# Altium schematic sheet CAN.SchDoc
size A4; SheetNumber: 4; SheetTotal: 5
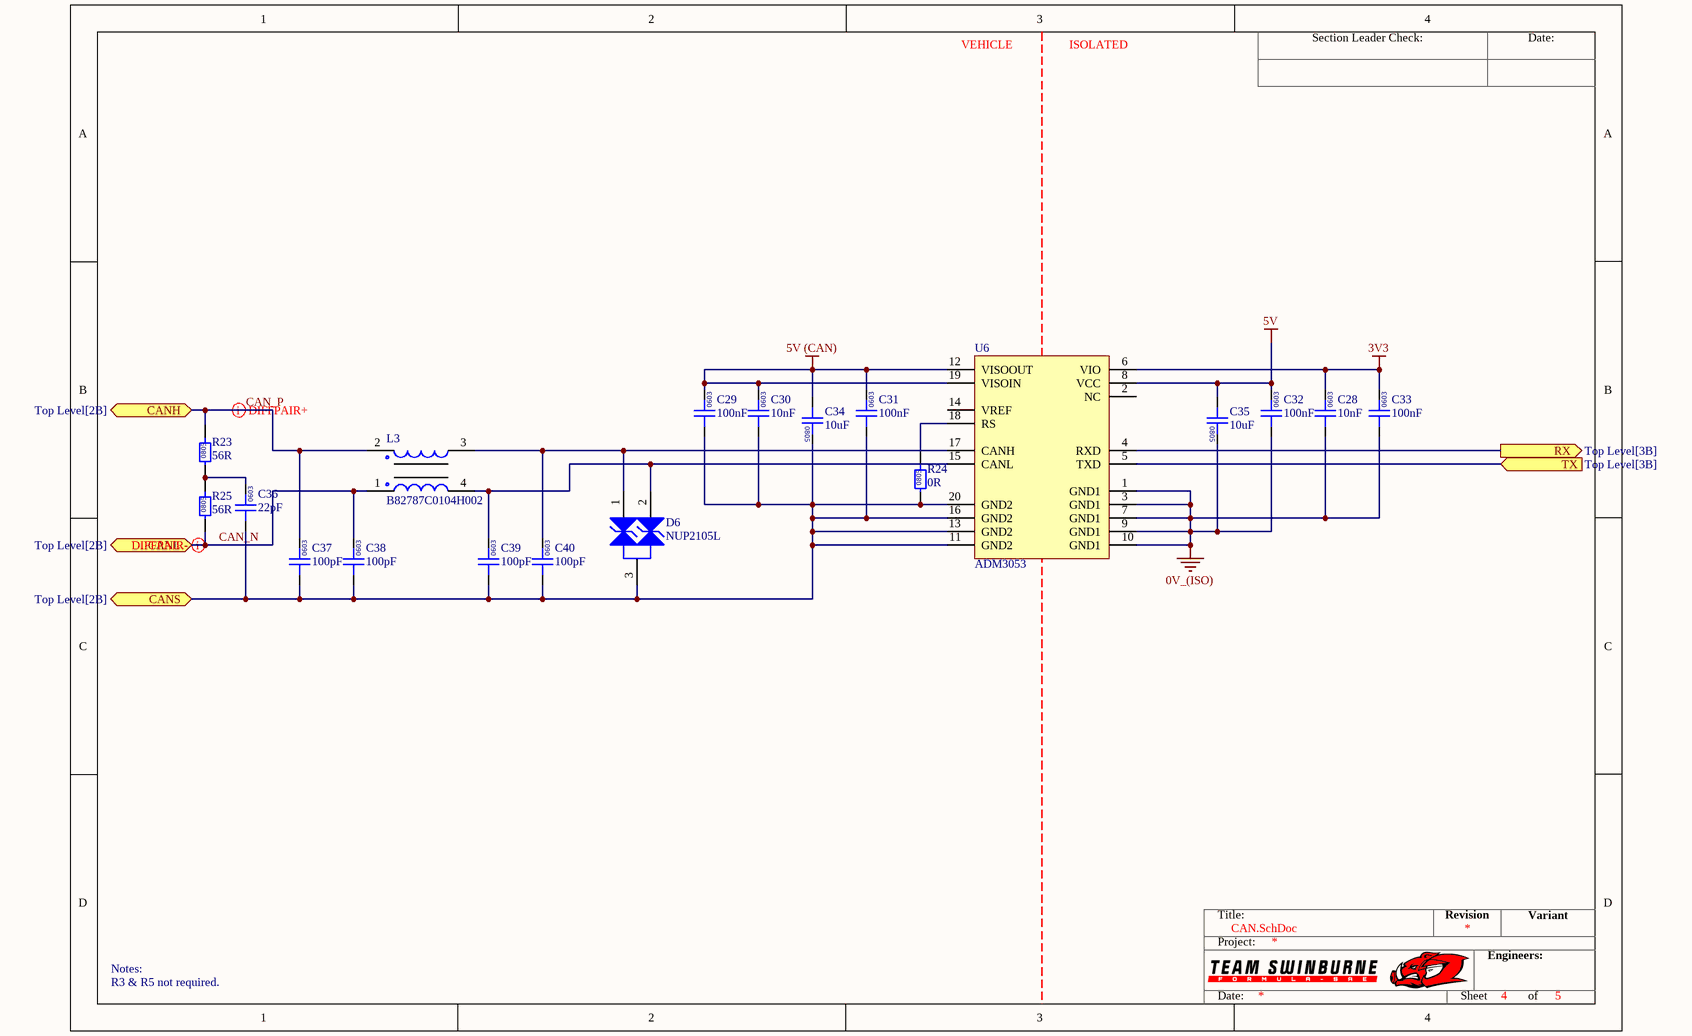
[diagram p0: CAN.SchDoc]

## Parts
C28  10nF  [0603]
C29  100nF  [0603]
C30  10nF  [0603]
C31  100nF  [0603]
C32  100nF  [0603]
C33  100nF  [0603]
C34  10uF  [0805]
C35  10uF  [0805]
C36  22pF  [0603]
C37  100pF  [0603]
C38  100pF  [0603]
C39  100pF  [0603]
C40  100pF  [0603]
D6  NUP2105L  [ONSC-SOT-23-3-318-08_V]
L3  B82787C0104H002  [TDK 4-PC Pad]
R23  56R  [0805]
R24  0R  [0805]
R25  56R  [0805]
U6  ADM3053  [AD SOIC-W 20]

## Ports
CANH (bidir, see Top Level[2B]), CANL (bidir, see Top Level[2B]), CANS (bidir, see Top Level[2B]), RX (out, see Top Level[3B]), TX (in, see Top Level[3B])

## Nets
0V_(ISO): C28.1 C32.1 C33.1 C35.2 U6.1(GND1) U6.3(GND1) U6.7(GND1) U6.9(GND1) U6.10(GND1)
3V3: C28.2 C33.2 U6.6(VIO)
5V: C32.2 C35.1 U6.8(VCC)
5V (CAN): C29.2 C30.2 C31.2 C34.1 U6.12(VISOOUT) U6.19(VISOIN)
CAN_N: C38.2 L3.1 R25.1 ; port CANL
CAN_P: C37.2 L3.2 R23.2 ; port CANH
CANS: C29.1 C30.1 C31.1 C34.2 C36.1 C37.1 C38.1 C39.1 C40.1 D6.3(K) R24.1 U6.11(GND2) U6.13(GND2) U6.16(GND2) U6.20(GND2) ; port CANS
RX: U6.4(RXD) ; port RX
TX: U6.5(TXD) ; port TX
NetC36_2: C36.2 R23.1 R25.2
NetC39_2: C39.2 D6.2(K) L3.4 U6.15(CANL)
NetC40_2: C40.2 D6.1(K) L3.3 U6.17(CANH)
NetR24_2: R24.2 U6.18(RS)

Not connected (* = marked no-connect by the designer): U6 2(NC) 14(VREF)

## Layout directives
differential pair: CAN_N, CAN_P

## Notes on the sheet
- VEHICLE
- ISOLATED
- Notes:
- R3 & R5 not required.
- Section Leader Check:
- Date:
- Title:
- Revision
- Variant
- Project:
- Engineers:
- Sheet
- of
- (in symbol GCM188L81H103KA03D) 0603
- (in symbol GCM188L81H104KA57D) 0603
- (in symbol GRM21BR6YA106KE43L) 0805
- (in symbol GRM0335C1H220JA01D) 0603
- (in symbol GRM1885C1H101JA01D) 0603
- (in symbol RC0805FR070RL) 0805
- (in symbol RC0805FR0756RL) 0805

## Library data of the parts
C28 C30 = GCM188L81H103KA03D: Manufacturer: muRata; Rated Voltage: 50V; Tolerance: ±10%; Material: MLCC; Temperature Rating: X8L; Part Number: GCM188L81H103KA03D; Value: 10nF; Digikey Part Number: 490-GCM188L81H103KA03DCT-ND
C29 C31-C33 = GCM188L81H104KA57D: Manufacturer: muRata; Rated Voltage: 50V; Tolerance: ±10%; Material: MLCC; Temperature Rating: X8L; Part Number: GCM188L81H104KA57D; Value: 100nF; Digikey Part Number: 490-6049-1-ND
C34 C35 = GRM21BR6YA106KE43L: Manufacturer: muRata; Rated Voltage: 50V; Tolerance: 10%; Material: MLCC; Temperature Rating: X5R; Part Number: GRM21BR6YA106KE43L; Value: 10uF; Digikey Part Number: 490-10514-6-ND
C36 = GRM0335C1H220JA01D: Manufacturer: Murata Electronics; Rated Voltage: 50V; Tolerance: ±5%; Material: MLCC; Temperature Rating: C0G, NP0; Part Number: GRM0335C1H220JA01D; Value: 22pF; Digikey Part Number: 490-6123-1-ND
C37-C40 = GRM1885C1H101JA01D: Manufacturer: Murata Electronics; Rated Voltage: 50V; Tolerance: ±5%; Material: MLCC; Temperature Rating: C0G, NP0; Part Number: GRM1885C1H101JA01D; Value: 100pF; Digikey Part Number: 490-1427-1-ND
D6 = CMP-004-00000-1: NUP2105L Series 350 W Dual Line CAN Bus Protector ESD Protection Diode - SOT-23; Max Breakdown Voltage: 32V; Clamping Voltage: 44V; Number of Lines: 2; Direction: Bidirectional; Reverse Standoff Voltage: 24V; Min Breakdown Voltage: 26.2V; Peak Pulse Current: 8A; ESD Protection: Yes; Test Current: 1mA; Diode Type: ZENER; Max Power Dissipation: 350W; Capacitance: 30pF; Leakage Current: 100nA; Power Line Protection: No; Depth: 1.3mm; Package Quantity: 1; Element Configuration: Dual; Termination: SMD/SMT; Radiation Hardening: No; Min Operating Temperature: -55°C; Contact Plating: Tin,Matte; Packaging: Tape and Reel; Polarity: Bidirectional; Resistor Type: Zener; Clamping Voltage-Max: 44V; Height: 0.94mm; Max Surge Current: 8A; RoHS Compliant: Yes; Width: 1.3mm; Lead Free: Lead Free; Case/Package: SOT-23-3; Number of Channels: 2; Series: Automotive, AEC-Q101; Halogen Free: Halogen Free; Breakdown Voltage: 26.2V; Working Voltage: 24V; Operating Supply Voltage: 24V; Max Operating Temperature: 150°C; REACH SVHC: No SVHC; Number of Pins: 3; Max Reverse Leakage Current: 100nA; Peak Pulse Power: 350W; Length: 2.9mm; Number of Bidirectional Channels: 2
L3 = B82787C0104H002: Manufacturer: EPCOS (TDK); Value: 100µH @ 100kHz; Impedance: 5.8 kOhms @ 10MHz; Rated Current: 150mA; Material: Wirewound; Part Number: B82787C0104H002; Digikey Part Number: 495-4598-1-ND
R23 R25 = RC0805FR0756RL: Manufacturer: YAGEO; Tolerance: 0.01; Rated Power: 0.125W; Part Number: RC0805FR0756RL; Value: 56R; Material: FR-07; Digikey Part Number: 311-56.0CRCT-ND
R24 = RC0805FR070RL: Manufacturer: YAGEO; Tolerance: 0.01; Rated Power: 0.125W; Part Number: RC0805FR070RL; Value: 0R; Material: FR-07; Digikey Part Number: 311-0.0CRCT-ND
U6 = ADM3053: Isolated CAN Transceiver; Manufacturer: Analogue Devices; Part Number: ADM3053; Digikey Part Number: ADM3053BRWZ-ND; Digikey Link: https://www.digikey.com/product-detail/en/analog-devices-inc/ADM3053BRWZ/ADM3053BRWZ-ND/2709332